# EAGLE design Wheel_Encoder_Adapter_Schmitt (EAGLE 5.11)
BOM: INCLUDE; DATABASE: ./../../../Eagle/PARTSDB.txt; PARTNO: TL331IDBVR
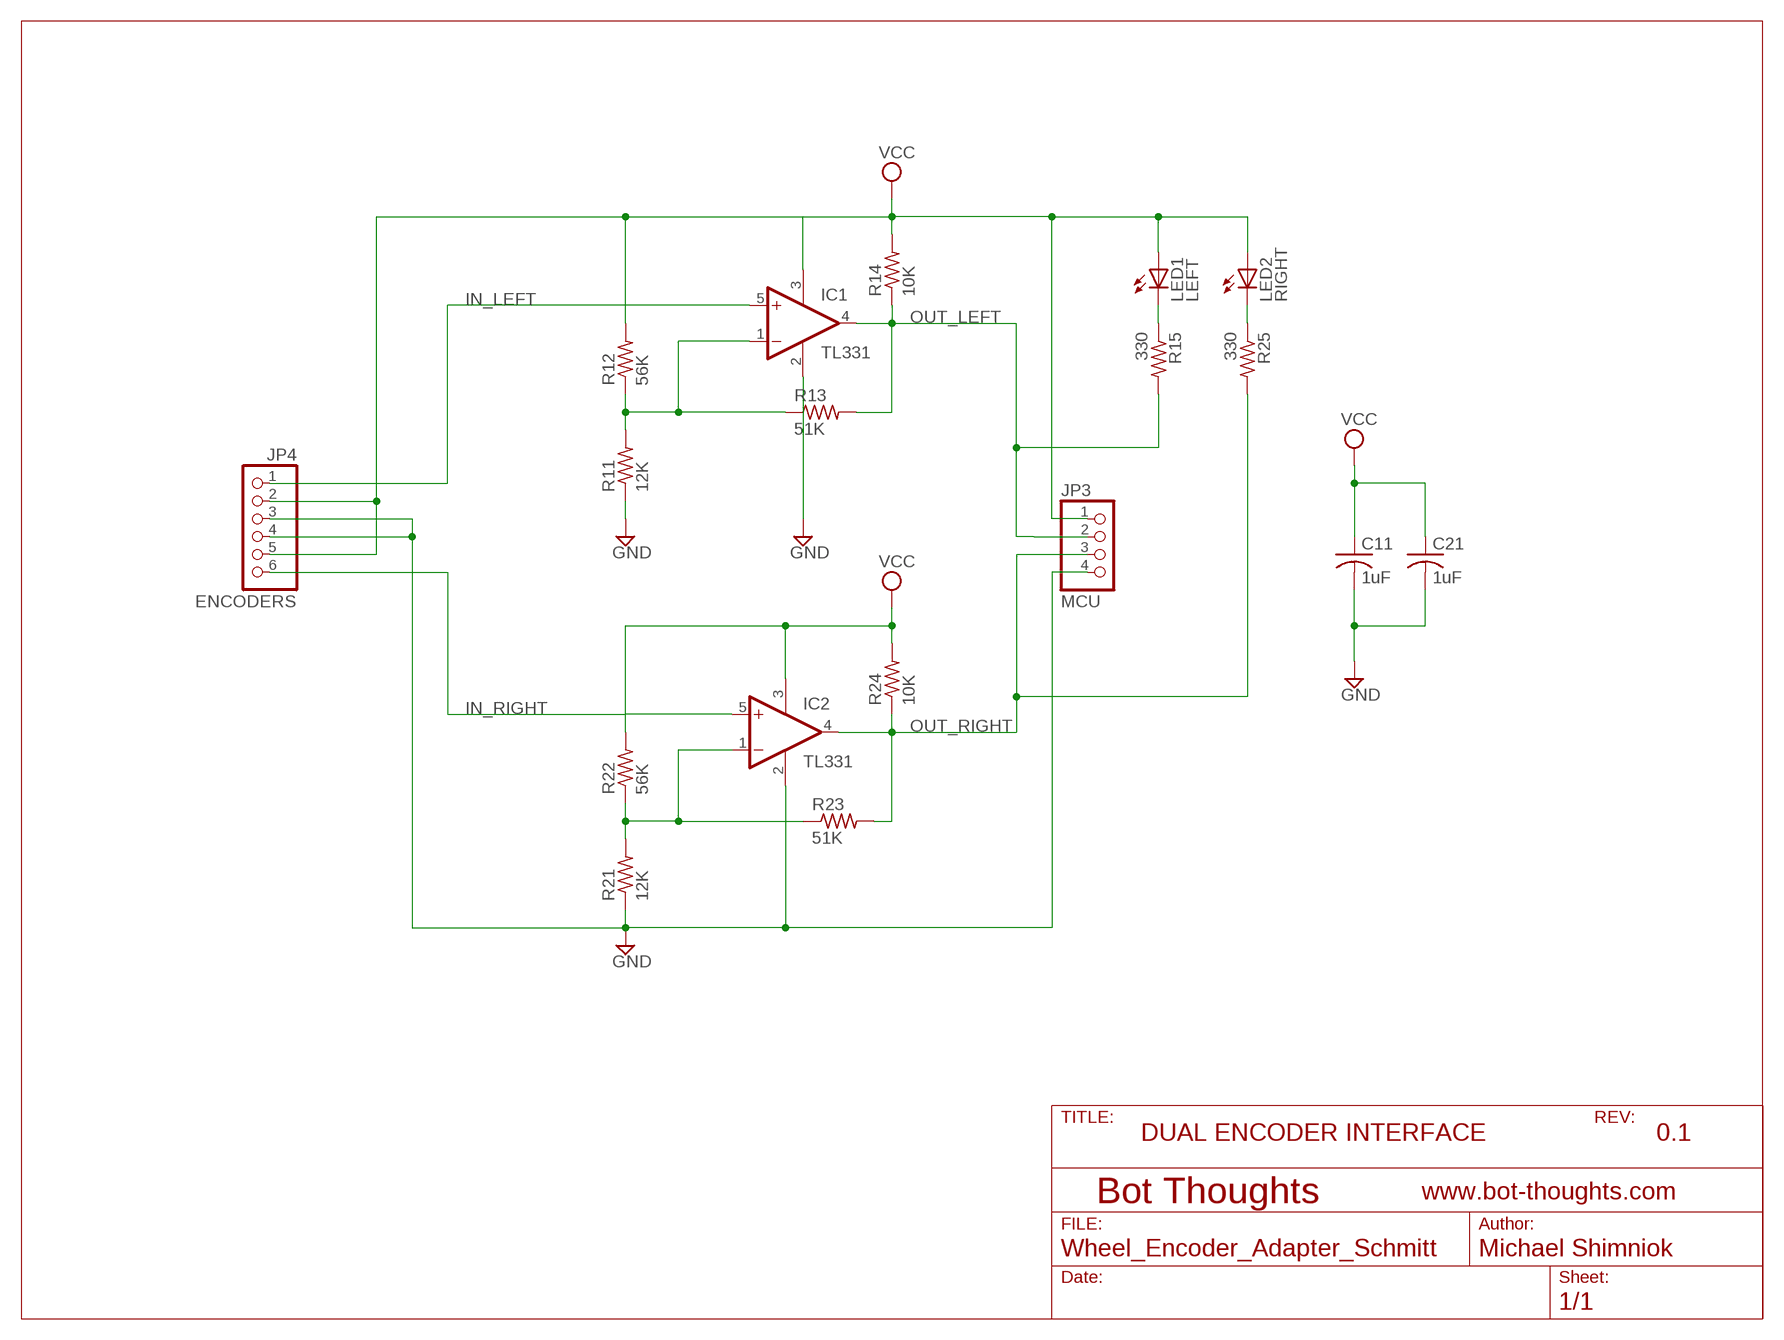
[diagram p0: schematic, sheet 1]

## Parts
C11  1uF  C-USC0603  [C0603]
C21  1uF  C-USC0603  [C0603]
IC1  TL331  [DBV-R-PDSO-G5]
IC2  TL331  [DBV-R-PDSO-G5]
JP3  MCU  PINHD-1X04_2.54-S  [1X04-S]
JP4  ENCODERS  PINHD-1X06_2.54-S  [1X06-S]
LED1  LEFT  LEDCHIPLED_1206  [CHIPLED_1206]
LED2  RIGHT  LEDCHIPLED_1206  [CHIPLED_1206]
R11  12K  R-US_R0603  [R0603]
R12  56K  R-US_R0603  [R0603]
R13  51K  R-US_R0603  [R0603]
R14  10K  R-US_R0603  [R0603]
R15  330  R-US_R0603  [R0603]
R21  12K  R-US_R0603  [R0603]
R22  56K  R-US_R0603  [R0603]
R23  51K  R-US_R0603  [R0603]
R24  10K  R-US_R0603  [R0603]
R25  330  R-US_R0603  [R0603]

## Nets
GND: C11.2 C21.2 IC1.2(GND) IC2.2(GND) JP3.4 JP4.3 JP4.4 R11.1 R21.1
IN_LEFT: IC1.5(+IN) JP4.1
IN_RIGHT: IC2.5(+IN) JP4.6
N$1: LED1.C R15.1
N$2: IC1.1(-IN) R11.2 R12.1 R13.1
N$3: LED2.C R25.1
N$7: IC2.1(-IN) R21.2 R22.1 R23.1
OUT_LEFT: IC1.4(OUT) JP3.2 R13.2 R14.1 R15.2
OUT_RIGHT: IC2.4(OUT) JP3.3 R23.2 R24.1 R25.2
VCC: C11.1 C21.1 IC1.3(V+) IC2.3(V+) JP3.1 JP4.2 JP4.5 LED1.A LED2.A R12.2 R14.2 R22.2 R24.2

## Notes on the sheet
- DUAL ENCODER INTERFACE | 0.1

## Library data of the parts
C11 C21 = rcl:C-US: CAPACITOR, American symbol
IC1 IC2 = linear:TL331: SINGLE DIFFERENTIAL COMPARATOR Source: http://www.ti.com .. tl331.pdf
JP3 = pinhead-2:PINHD-1X04: PIN HEADER
JP4 = pinhead-2:PINHD-1X06: PIN HEADER
LED1 LED2 = led:LED: LED OSRAM: - CHIPLED LG R971, LG N971, LY N971, LG Q971, LY Q971, LO R971, LY R971 LH N974, LH R974 LS Q976, LO Q976, LY Q976 LO Q996 - Hyper CHIPLED LW Q18S LB Q993, LB Q99A, LB R99A - SideLED LS A670, LO A670, LY A670, LG A670, LP A670 LB A673, LV A673, LT A673, LW A673 LH A674 LY A675 LS A676, LA A676, LO A676, LY A676, LW A676 LS A679, LY A679, LG A679 - Hyper Micro SIDELED® LS Y876, LA Y876, LO Y876, LY Y876 LT Y87S - SmartLED LW L88C, LW L88S LB L89C, LB L89S, LG L890 LS L89K, LO L89K, LY L89K LS L896, LA L896, LO L896, LY L896 - TOPLED LS T670, LO T670, LY T670, LG T670, LP T670 LSG T670, LSP T670, LSY T670, LOP T670, LYG T670 LG T671, LOG T671, LSG T671 LB T673, LV T673, LT T673, LW T673 LH T674 LS T676, LA T676, LO T676, LY T676, LB T676, LH T676, LSB T676, LW T676 LB T67C, LV T67C, LT T67C, LS T67K, LO T67K, LY T67K, LW E67C LS E67B, LA E67B, LO E67B, LY E67B, LB E67C, LV E67C, LT E67C LW T67C LS T679, LY T679, LG T679 LS T770, LO T770, LY T770, LG T770, LP T770 LB T773, LV T773, LT T773, LW T773 LH T774 LS E675, LA E675, LY E675, LS T675 LS T776, LA T776, LO T776, LY T776, LB T776 LHGB T686 LT T68C, LB T68C - Hyper Mini TOPLED® LB M676 - Mini TOPLED Santana® LG M470 LS M47K, LO M47K, LY M47K Source: http://www.osram.convergy.de LUXEON: - LUMILED® LXK2-PW12-R00, LXK2-PW12-S00, LXK2-PW14-U00, LXK2-PW14-V00 LXK2-PM12-R00, LXK2-PM12-S00, LXK2-PM14-U00 LXK2-PE12-Q00, LXK2-PE12-R00, LXK2-PE12-S00, LXK2-PE14-T00, LXK2-PE14-U00 LXK2-PB12-K00, LXK2-PB12-L00, LXK2-PB12-M00, LXK2-PB14-N00, LXK2-PB14-P00, LXK2-PB14-Q00 LXK2-PR12-L00, LXK2-PR12-M00, LXK2-PR14-Q00, LXK2-PR14-R00 LXK2-PD12-Q00, LXK2-PD12-R00, LXK2-PD12-S00 LXK2-PH12-R00, LXK2-PH12-S00 LXK2-PL12-P00, LXK2-PL12-Q00, LXK2-PL12-R00 Source: www.luxeon.com KINGBRIGHT: KA-3528ASYC Source: www.kingbright.com
R11-R15 R21-R25 = resistor:R-US_: RESISTOR, American symbol

## Board
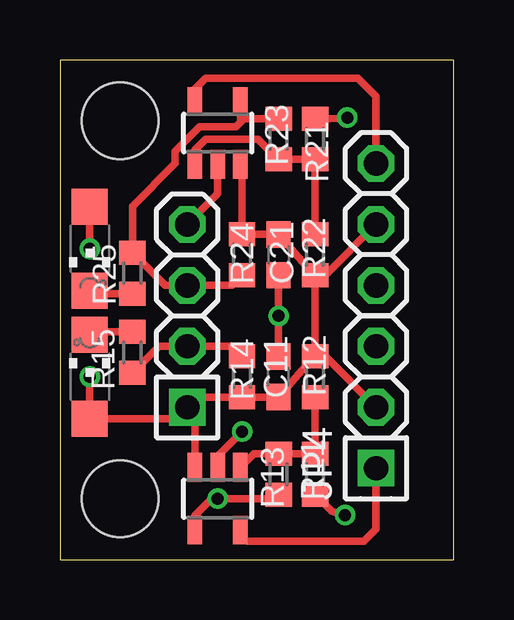
[diagram p1: board, top side]
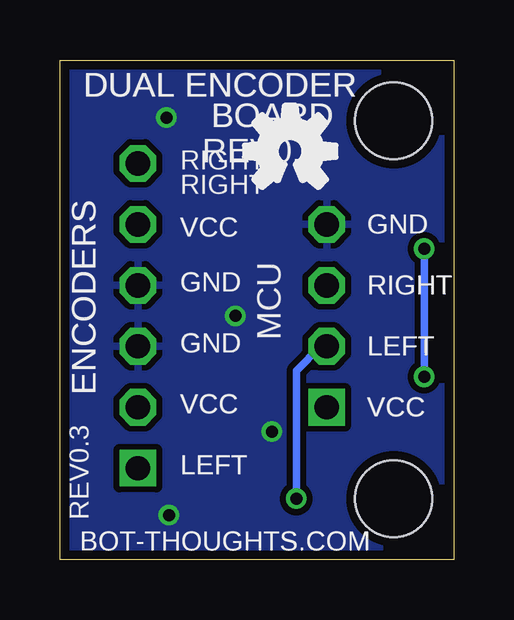
[diagram p2: board, bottom side, seen from below]

Size 16.43 x 20.82 mm. Coordinates in mm from the lower left corner, seen from the top.
Outline: 0,0 16.43,0 16.43,20.82 0,20.82 0,0
Copper layers (1*16): Top 0.0356mm / dielectric 1.5011mm / Bottom 0.0356mm
Design rules "LaenPCBOrder": minimum track width 6mil, minimum drill 13mil, track to track 6mil, track to pad 6mil, pad to pad 6mil, via to via 6mil, smd to smd 6mil, copper to edge 15mil, drill to drill 6mil, minimum pad ring 7mil, minimum via ring 7mil, stop-mask expansion 4mil, vias tented up to drill 0mil, thermal gap 10mil
Holes 3.2 mm at 2.51,18.29 2.51,2.54

### Footprints (pad centres in the part's own frame; a part is rotated, then mirrored left to right if it is on the bottom)
C0603 = smd 1.1 x 1: 1 -0.85,0; 2 0.85,0
DBV-R-PDSO-G5 = smd 0.6 x 1.2: 1 -0.95,-1.306; 2 0,-1.306; 3 0.95,-1.306; 4 0.95,1.306; 5 -0.95,1.306
1X04-S = drill 1.016 square: 1 -3.81,0 | drill 1.016 octagon: 2 -1.27,0; 3 1.27,0; 4 3.81,0
1X06-S = drill 1.016 square: 1 -6.35,0 | drill 1.016 octagon: 2 -3.81,0; 3 -1.27,0; 4 1.27,0; 5 3.81,0; 6 6.35,0
CHIPLED_1206 = smd 1.5 x 1.5: A 0,-1.75; C 0,1.75
R0603 = smd 1 x 1.1: 1 -0.85,0; 2 0.85,0

### Placement (x,y rotation side)
C11  9.12,7.62 90 top
C21  9.12,12.7 270 top
IC1  6.58,2.54 180 top
IC2  6.58,17.78 0 top
JP3  5.31,10.16 90 top
JP4  13.18,10.16 90 top
LED1  1.24,7.62 0 top
LED2  1.24,12.95 180 top
R11  10.64,3.56 90 top
R12  10.64,7.62 90 top
R13  9.12,3.56 270 top
R14  7.59,7.62 270 top
R15  100  [R0603]  3.02,8.64 270 top
R21  10.64,17.53 270 top
R22  10.64,12.7 270 top
R23  9.12,17.53 90 top
R24  7.59,12.7 90 top
R25  100  [R0603]  3.02,11.94 90 top

### Tracks (layer width: path | path; a pad name or v marks a point on that pad's centre or on a via)
GND  (via drill 0.5)
  Top 0.305: IC1.2 6.58,4.32 v7.59,5.33 | C11.2 v9.12,10.16 C21.2 | R11.1 11.34,2.02 v11.89,1.85 | IC2.2 6.58,15.24 JP3.4 | R21.1 11.24,18.38 v11.99,18.41
  pour Bottom (isolate 0.254): -0.25,0 -0.25,20.83 16.38,20.83 16.38,0
IN_LEFT
  Top 0.305: IC1.5 7.53,0.83 7.85,0.76 12.67,0.76 13.18,1.27 JP4.1
IN_RIGHT
  Top 0.305: IC2.5 5.63,19.62 6.07,20.07 12.42,20.07 13.18,19.3 JP4.6
N$1
  Top 0.305: R15.1 1.36,9.49 LED1.C
N$2
  Top 0.305: R12.1 R11.2 R13.1 8.09,4.41 IC1.1
N$3
  Top 0.305: R25.1 1.36,11.09 LED2.C
N$7
  Top 0.305: R22.1 R21.2 R23.1 8.27,17.53 6.07,17.53 5.63,17.08 IC2.1
OUT_LEFT  (via drill 0.5)
  Top 0.305: R15.2 4.13,8.89 JP3.2 7.17,8.89 R14.1 | IC1.4 5.63,1.34 5.63,1.84 6.32,2.54 v6.58,2.54 8.95,2.54 R13.2
  Bottom 0.305: JP3.2 5.56,8.89 6.58,7.87 v6.58,2.54
OUT_RIGHT
  Top 0.305: R24.1 7.17,11.43 JP3.3 4.38,11.43 R25.2 3.02,14.73 4.8,16.51 4.8,17.02 5.82,18.03 7.34,18.03 7.53,18.22 | 7.53,18.22 IC2.4 | R23.2 7.68,18.38 7.53,18.22
VCC  (via drill 0.5)
  Top 0.305: JP3.1 4.83,5.87 LED1.A v1.24,7.62 | v1.24,12.95 LED2.A | IC1.3 5.63,6.03 JP3.1 | JP3.1 5.65,6.77 R14.2 C11.1 10.39,8.22 R12.2 | R12.2 11.06,8.47 JP4.2 | R12.2 R22.2 | R22.2 11.06,11.85 JP4.5 | IC2.3 7.59,16.15 R24.2 C21.1 10.39,12.1 R22.2
  Bottom 0.305: v1.24,7.62 v1.24,12.95

### Text on the board
bNames: DUAL ENCODER | BOARD | REV0.3 | RIGHT | GND | VCC | RIGHT | GND | LEFT | GND | ENCODERS | VCC | VCC | LEFT | BOT-THOUGHTS.COM
_bsilk: DUAL ENCODER | BOARD | RIGHT | GND | VCC | RIGHT | GND | LEFT | MCU | GND | ENCODERS | VCC | VCC | LEFT | REV0.3 | BOT-THOUGHTS.COM